# Altium schematic sheet СхемаПолумостовая.SchDoc
size A4; SheetNumber: 1; SheetTotal: 1
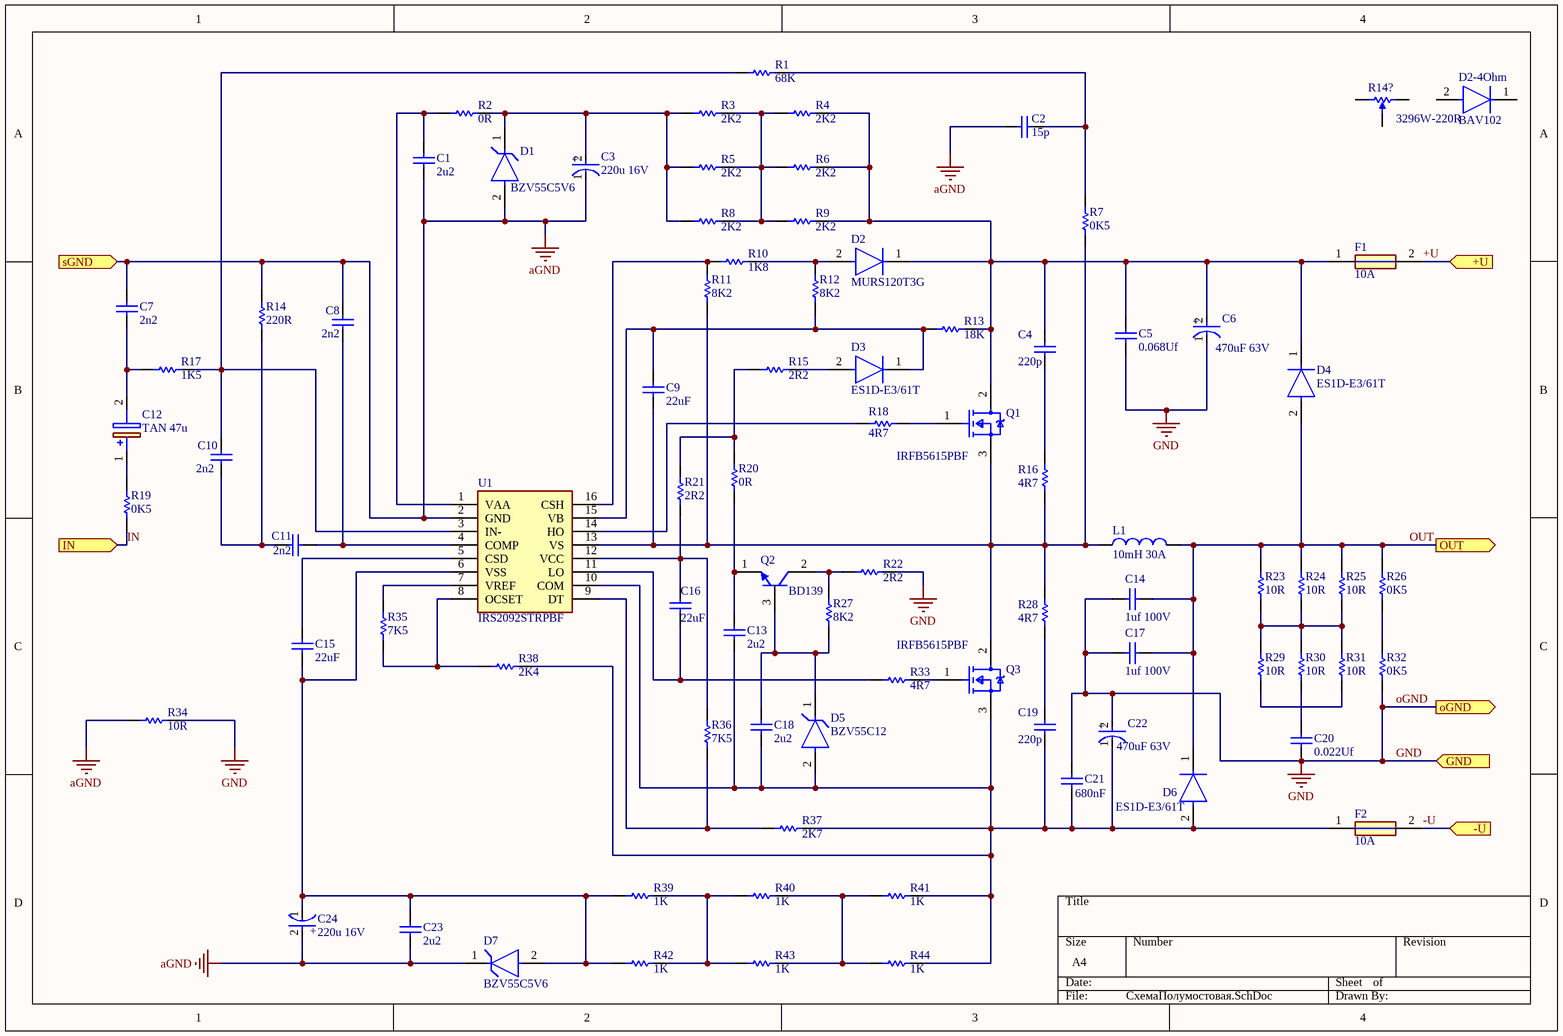
[diagram p0: СхемаПолумостовая.SchDoc]

## Parts
C1  2u2  [CAPC2013X145X50ML20T25]
C2  15p  [CAPC2013X145X50ML20T25]
C3  220u 16V  [FP-OS-CON-SMT-C6-MFG]
C4  220p  [CAPC2013X145X50ML20T25]
C5  0.068Uf  [WCAP-FTX2_L10W6H12_CS]
C6  470uF 63V  [FP-RAD-TH-D_12_5_0_5-L_20-MFG]
C7  2n2  [CAPC2013X145X50ML20T25]
C8  2n2  [CAPC2013X145X50ML20T25]
C9  22uF  [CAPC5950X255X70LL75T35]
C10  2n2  [CAPC2013X145X50ML20T25]
C11  2n2  [CAPC2013X145X50ML20T25]
C12  TAN 47u  [CAPPC5760X640N]
C13  2u2  [CAPC2013X145X50ML20T25]
C14  1uf 100V  [WCAP-FTBP_L18W7H13]
C15  22uF  [CAPC5950X255X70LL75T35]
C16  22uF  [CAPC5950X255X70LL75T35]
C17  1uf 100V  [WCAP-FTBP_L18W7H13]
C18  2u2  [CAPC2013X145X50ML20T25]
C19  220p  [CAPC2013X145X50ML20T25]
C20  0.022Uf  [WCAP-FTX2_L13W4.5H9.5]
C21  680nF  [WCAP-FTX2_L10W6H12_CS]
C22  470uF 63V  [FP-RAD-TH-D_12_5_0_5-L_20-MFG]
C23  2u2  [CAPC2013X145X50ML20T25]
C24  220u 16V  [FP-OS-CON-SMT-C6-MFG]
D1  BZV55C5V6  [FP-DO-213AA-MFG]
D2  MURS120T3G  [FP-403A-03-MFG]
D2-4Ohm  BAV102  [FP-100AD-IPC_A]
D3  ES1D-E3/61T  [FP-95400-MFG]
D4  ES1D-E3/61T  [FP-95400-MFG]
D5  BZV55C12  [FP-DO-213AA-MFG]
D6  ES1D-E3/61T  [FP-95400-MFG]
D7  BZV55C5V6  [FP-DO-213AA-MFG]
F1  10A  [FUSC6025X270N]
F2  10A  [FUSC6025X270N]
L1  10mH 30A  [744151]
Q1  IRFB5615PBF  [FP-PG-TO220-3-MFG]
Q2  BD139  [ONSC-TO-225-3-77-09]
Q3  IRFB5615PBF  [FP-PG-TO220-3-MFG]
R1  68K  [RESC2013X60X35ML10T20]
R2  0R  [RESC2013X60X35ML10T20]
R3  2K2  [RESC2013X60X35ML10T20]
R4  2K2  [RESC2013X60X35ML10T20]
R5  2K2  [RESC2013X60X35ML10T20]
R6  2K2  [RESC2013X60X35ML10T20]
R7  0K5  [RESC2013X60X35ML10T20]
R8  2K2  [RESC2013X60X35ML10T20]
R9  2K2  [RESC2013X60X35ML10T20]
R10  1K8  [RESC2013X60X35ML10T20]
R11  8K2  [RESC2013X60X35ML10T20]
R12  8K2  [RESC2013X60X35ML10T20]
R13  18K  [RESC2013X60X35ML10T20]
R14  220R  [RESC2013X60X35ML10T20]
R14?  3296W-220R  [BOUR-3296W-1-3]
R15  2R2  [RESC3116X65X40ML10T20]
R16  4R7  [RESC2013X60X35ML10T20]
R17  1K5  [RESC2013X60X35ML10T20]
R18  4R7  [RESC2013X60X35ML10T20]
R19  0K5  [RESC2013X60X35ML10T20]
R20  0R  [RESC2010(5025)_L]
R21  2R2  [RESC3116X65X40ML10T20]
R22  2R2  [RESC3116X65X40ML10T20]
R23  10R  [RESC2013X60X35ML10T20]
R24  10R  [RESC2013X60X35ML10T20]
R25  10R  [RESC2013X60X35ML10T20]
R26  0K5  [RESC2013X60X35ML10T20]
R27  8K2  [RESC2013X60X35ML10T20]
R28  4R7  [RESC2013X60X35ML10T20]
R29  10R  [RESC2013X60X35ML10T20]
R30  10R  [RESC2013X60X35ML10T20]
R31  10R  [RESC2013X60X35ML10T20]
R32  0K5  [RESC2013X60X35ML10T20]
R33  4R7  [RESC2013X60X35ML10T20]
R34  10R  [RESC2013X60X35ML10T20]
R35  7K5  [RESC2013X60X35ML10T20]
R36  7K5  [RESC2013X60X35ML10T20]
R37  2K7  [RESC2013X60X35ML10T20]
R38  2K4  [RESC2013X60X35ML10T20]
R39  1K  [RESC2013X60X35ML10T20]
R40  1K  [RESC2013X60X35ML10T20]
R41  1K  [RESC2013X60X35ML10T20]
R42  1K  [RESC2013X60X35ML10T20]
R43  1K  [RESC2013X60X35ML10T20]
R44  1K  [RESC2013X60X35ML10T20]
U1  IRS2092STRPBF  [SOIC127P600X175-16N]

## Ports
+U (in), -U (in), GND (in), IN (in), oGND (out), OUT (out), sGND (in)

## Nets
aGND: C1.1 C2.1 C3.1(C) C7.2 C8.2 C23.1 C24.2(A) D1.2(A) D7.1(C) R14.2 R34.1 U1.2(GND) ; port sGND
GND: C5.1 C6.1(C) C14.1 C17.1 C20.1 C21.2 C22.2(A) R22.2 R32.1 R34.2 ; port GND, port oGND  [also labelled oGND]
+U: F1.2 ; port +U
-U: F2.2 ; port -U
IN: R19.1 ; port IN
OUT: C14.2 C17.2 D4.2(A) D6.1(C) L1.2 R23.2 R24.2 R25.2 R26.2 ; port OUT
NetC1_2: C1.2 R2.1 U1.1(VAA)
NetC2_2: C2.2 R1.2 R7.2
NetC3_2: C3.2(A) D1.1(C) R2.2 R3.1 R5.1 R8.1
NetC4_1: C4.1 R16.2
NetC4_2: C4.2 C5.2 C6.2(A) D2.1(C) D4.1(C) F1.1 Q1.2(D) R4.2 R6.2 R9.2 R13.2
NetC7_1: C7.1 C12.2(-) R17.1
NetC8_1: C8.1 C11.2 U1.4(COMP)
NetC9_1: C9.1 L1.1 Q1.3(S) Q3.2(D) R7.1 R11.1 R16.1 R28.2 U1.13(VS)
NetC9_2: C9.2 D3.1(C) R12.1 R13.1 U1.15(VB)
NetC10_1: C10.1 C11.1 R14.1
NetC10_2: C10.2 R1.1 R17.2 U1.3(IN-)
NetC12_1: C12.1(+) R19.2
NetC13_1: C13.1 C18.1 C19.1 C21.1 C22.1(C) D5.2(A) D6.2(A) F2.1 Q3.3(S) R37.2 R38.2 R41.2 R44.2 U1.10(COM)
NetC13_2: C13.2 Q2.1(E) R20.1
NetC15_1: C15.1 C23.2 C24.1(C) D7.2(A) R39.1 R42.1 U1.6(VSS)
NetC15_2: C15.2 U1.5(CSD)
NetC16_1: C16.1 R33.1 U1.11(LO)
NetC16_2: C16.2 R21.1 R36.2 U1.12(VCC)
NetC18_2: C18.2 D5.1(C) Q2.3(B) R27.1
NetC19_2: C19.2 R28.1
NetC20_2: C20.2 R30.1
NetD2_2: D2.2(A) R10.2 R12.2
NetD3_2: D3.2(A) R15.2
NetQ1_1: Q1.1(G) R18.2
NetQ2_2: Q2.2(C) R22.1 R27.2
NetQ3_1: Q3.1(G) R33.2
NetR3_2: R3.2 R4.1 R5.2 R6.1 R8.2 R9.1
NetR10_1: R10.1 R11.2 U1.16(CSH)
NetR15_1: R15.1 R20.2 R21.2
NetR18_1: R18.1 U1.14(HO)
NetR23_1: R23.1 R24.1 R25.1 R29.2 R30.2 R31.2
NetR26_1: R26.1 R32.2
NetR29_1: R29.1 R31.1
NetR35_1: R35.1 R38.1 U1.8(OCSET)
NetR35_2: R35.2 U1.7(VREF)
NetR36_1: R36.1 R37.1 U1.9(DT)
NetR39_2: R39.2 R40.1 R42.2 R43.1
NetR40_2: R40.2 R41.1 R43.2 R44.1

Not connected (* = marked no-connect by the designer): D2-4Ohm 1(C) 2(A); R14? 1(A) 2(B) 3(TAP)

## Notes on the sheet
- (in symbol CMP-05427-001729-1) +
- (in symbol CMP-05428-001013-1) +

## Library data of the parts
C1 C2 C4 C7 C8 C10 C11 C13 C18 C19 C23 = CMP-1036-04819-2: Part Number: C0805C225K9PACTU; Manufacturer: Kemet
C3 C24 = CMP-05428-001013-1: Conductive Polymer Aluminum Solid Capacitors (OS-CON) 220uF ±20% 16V; Life (Hours): 1000Hour; ESR (Equivalent Series Resistance): 22mR; Case/Package: Radial; Mount: Surface Mount; Packaging: Tape and Reel; Tolerance: 20%; Min Operating Temperature: -55°C; Max Operating Temperature: 125°C; Capacitance: 220uF; Voltage Rating: 16V
C5 C21 = CMP-03913-51400083-2: 890324022017CS Capacitor, Film, Polypropylene, 0.068Uf, 275Vac, Radial; Voltage Rating (AC): 275V; Insulation Resistance: 30GΩ; Hole Diameter: 900µm; Capacitance: 68nF; Pitch: 7.5mm; Dielectric: PP; Pin Length: 4mm; Tolerance: 10%; Height - Seated (Max): 12.4968mm; NexarPartId: 51400083; REACH SVHC: Unknown; Packaging: Carton; Lead Pitch: 7.493mm; Length: 10mm; RoHS: Compliant; Mount: Through Hole; Width: 6mm; Voltage Rating (DC): 275V; Case/Package: Radial; Height: 12mm; Termination: PC Pins; Dielectric Material: PP; Voltage Rating: 275V; Min Operating Temperature: -40°C; Max Operating Temperature: 105°C
C6 C22 = CMP-05427-001729-1: Aluminum Electrolytic Capacitors (Radial Lead Type) AEC-Q200 Qualified 470uF ±20% 63V; Life (Hours): 2000Hour; Lead Diameter: 0.6mm; Ripple Current: 640mA; Lead/Base Style: Straight; Contact Plating: Tin; Case/Package: Radial; Max Operating Temperature: 105°C; Termination: Radial; Series: NHG; Package Quantity: 500; Tolerance: 20%; RoHS Compliant: Yes; Min Operating Temperature: -55°C; Construction: RADIAL; Lead Pitch: 5mm; Capacitance: 470uF; Diameter: 12.5mm; Voltage Rating (DC): 63V; Packaging: Ammo Pack; Length: 20mm; Radiation Hardening: No; Height: 20mm; Mount: Through Hole
C9 C15 C16 = CMP-1664-00005-1: Chip Capacitor, 22 uF, +/- 10%, 25 V, -55 to 125 degC, 2220 (5650 Metric), RoHS, Tape and Reel; Current Rating: 20 A; Voltage Rating: 33 V; Resistance: 200 mohm; Case\Package: 1812; RoHSCompliant: true; DatasheetVersion: Feb-16; REACH SVHC: No SVHC; Case Code (Imperial): 1812; PackageDescription: 2-Pin Surface Mount Device, Body 5.9 x 5 mm; Nominal Supply Voltage: 33 V; ComponentLink2Description: Datasheet; Case Code (Metric): 4532; Max Operating Temperature: 85 degC; Package Quantity: 1000; Height: 2 mm; Min Operating Temperature: -40 degC; Width: 3.41 mm; ComponentLink1URL: http://www.kemet.com/; Mount: Surface Mount; ComponentLink2URL: http://www.mouser.com/ds/2/212/KEM_C1013_X7R_FT-CAP_SMD-346914.pdf; Length: 4.73 mm; ComponentLink1Description: Manufacturer URL; Packaging: Tape and Reel; PackageReference: 2220
C12 = 597D476X0050Z2T: Capacitor Polarised; Manufacturer_Name: Vishay; Datasheet Link: http://www.vishay.com/doc?40047; Height: 6.4mm; Manufacturer_Part_Number: 597D476X0050Z2T; Mouser Part Number: 71-597D476X0050Z2T; Mouser Price/Stock: https://www.mouser.co.uk/ProductDetail/Vishay-Sprague/597D476X0050Z2T?qs=cyBetVxIfqkOZXvQZwfF4Q%3D%3D; Arrow Part Number: 597D476X0050Z2T; Arrow Price/Stock: https://www.arrow.com/en/products/597d476x0050z2t/vishay?region=nac
C14 C17 = CMP-03913-89437293-1: 890273325009CS Cap, 1Uf, 250V, Film, Radial Rohs Compliant: Yes; ESR (Equivalent Series Resistance): 22.08mΩ; Pin Length: 4mm; Pitch: 15mm; Capacitance: 1µF; NexarPartId: 89437293; Packaging: Carton; Voltage Rating: 250V; RoHS: Compliant; Height: 13mm; Length: 18mm; Width: 7mm
C20 = CMP-03913-52220317-2: 890324023011 Film Capacitor, Wcap-Ftx2 Series, 0.022 F, 10%, Pp (Polypropylene), 275 Vac Rohs Compliant: Yes; Voltage Rating: 275V; Capacitance: 22nF; Insulation Resistance: 30GΩ; Pitch: 10mm; Pin Length: 18mm; Hole Diameter: 900µm; Packaging: Bulk; Lead Pitch: 10.0076mm; Height: 9.5mm; Tolerance: 10%; REACH SVHC: Unknown; Dielectric Material: PP; RoHS: Compliant; Case/Package: Radial; Width: 4.5mm; Min Operating Temperature: -40°C; Max Operating Temperature: 105°C; Voltage Rating (DC): 275V; Mount: Through Hole; NexarPartId: 52220317; Height - Seated (Max): 10.0076mm; Termination: PC Pins; Dielectric: PP; Voltage Rating (AC): 275V; Length: 13mm
D1 D7 = CMP-00252-16640727-1: BZV55C5V6 Diode Zener Single 5.6V 2% 3.33mW 2-Pin MELF DO-213AA Bag; Test Current: 5mA; Voltage Tolerance: 7%; Min Operating Temperature: -65°C; RoHS: Non-Compliant; Element Configuration: Single; Number of Pins: 2; NexarPartId: 16640727; Zener Voltage: 5.6V; Lifecycle Status: Production; Mount: Surface Mount; Tolerance: 7%; Max Operating Temperature: 175°C
D2 = CMP-0902-00001-3: DIODE GEN PURP 200V 2A SMB; Element Configuration: Single; Recovery Time: 35ns; Output Current: 1A; Max Surge Current: 40A; Forward Voltage: 875mV; Peak Reverse Current: 2uA; Polarity: Standard; Average Rectified Current: 2A; Max Repetitive Reverse Voltage (Vrrm): 200V; Voltage Rating (DC): 200V; Height: 2.13mm; Reverse Voltage: 200V; Packaging: Tape and Reel; Min Operating Temperature: -65°C; Contact Plating: Tin; Forward Current: 2A; Max Operating Temperature: 175°C; Length: 4.32mm; REACH SVHC: No SVHC; Number of Pins: 2; Case/Package: SMB; Width: 3.56mm; Peak Non-Repetitive Surge Current: 40A; Lead Free: Lead Free; Current Rating: 1A; Max Forward Surge Current (Ifsm): 40A; Reverse Recovery Time: 35ns; Package Quantity: 2500; Radiation Hardening: No; Max Reverse Voltage (DC): 200V
D2-4Ohm = CMP-00278-84324523-1: BAV102 Diode Ultra Fast Recovery Rectifier 200V 0.2A 2-Pin LL-34 T/R; Manufacturer Lifecycle Status: ACTIVE; Power Dissipation: 500mW; Max Junction Temperature (Tj): 200°C; Output Current: 200mA; Reverse Recovery Time: 50ns; Max Reverse Voltage (DC): 150V; Max Surge Current: 4A; Polarity: Standard; Capacitance: 5pF; Max Forward Surge Current (Ifsm): 1A; Element Configuration: Single; Forward Voltage: 1.25V; Peak Reverse Current: 100nA; Min Operating Temperature: -65°C; Voltage Rating (DC): 200V; Mount: Surface Mount; RoHS: Compliant; Radiation Hardening: No; Average Rectified Current: 200mA; Peak Non-Repetitive Surge Current: 4A; Case/Package: MELF; Height: 1.5mm; Packaging: Cut Tape; Reverse Voltage: 200V; Max Repetitive Reverse Voltage (Vrrm): 200V; Current Rating: 200mA; Lead Free: Lead Free; NexarPartId: 84324523; Forward Current: 200mA; Schedule B: 8541100080, 8541100080; Max Operating Temperature: 200°C; Number of Pins: 34; Weight: 51.84mg; Lifecycle Status: Production; Recovery Time: 50ns
D3 D4 D6 = CMP-02540-000037-1: DIODE GEN PURP 200V 1A DO214AC; Manufacturer: Vishay; Standoff Height: 0mm; Peak Reverse Current: 5uA; Value: 10 pF; Max Surge Forward Current: 30A; Max Junction Temp: +150°C; Device Class L3: Rectifier Diodes; RoHS: TRUE; Device Class L1: Discrete Semiconductors; Lead Free: Yes; ComponentLink2Description: Datasheet; Digikey Description: DIODE GEN PURP 200V 1A DO214AC; Device Class L2: Diodes; Package: 95400; Max Repetitive Reverse Voltage: 200V; Footprint Url: http://www.vishay.com/docs/95400/sma.pdf; Temperature Range High: +150°C; ComponentLink2URL: http://www.vishay.com/docs/88586/es1.pdf; Automotive: No; Octopart: https://octopart.com/es1d-e3%2F61t-vishay-39550266; Manufacturer Part Number: ES1D-E3/61T; Temperature: -55°C to +150°C; Category: Diode; Temperature Range Low: -55°C; Height: 2.29mm; Capacitance: 10 pF; Mouser Description: Ultrafast Rectifier, Plastic Surface Mount, 1 A, 200 VDC, DO0214AC (SMA), RoHS; Forward Current: 1A
D5 = CMP-00252-75067900-1: BZV55C12 Zener Diode Single 12.05V 5% 25Ohm 500mW 2-Pin DO-213AA; Max Reverse Leakage Current: 100nA; Power Dissipation: 3.33mW; Reverse Voltage: 8V; Min Operating Temperature: -65°C; Zener Voltage: 12.05V; Height: 1.7mm; Max Operating Temperature: 175°C; NexarPartId: 75067900
F1 F2 = CCF1N10TTE: Fuse; Manufacturer_Name: KOA Speer; Datasheet Link: https://componentsearchengine.com/Datasheets/1/CCF1N10TTE.pdf; Height: 2.7mm; Manufacturer_Part_Number: CCF1N10TTE; Mouser Part Number: 660-CCF1N10TTE; Mouser Price/Stock: https://www.mouser.co.uk/ProductDetail/KOA-Speer/CCF1N10TTE?qs=rZB7yXOqaotLjZpPUC%2Fp3g%3D%3D; Arrow Part Number: CCF1N10TTE; Arrow Price/Stock: https://www.arrow.com/en/products/ccf1n10tte/koa-speer-electronics?region=nac
L1 = CMP-03913-22803296-1: 744151 48 µH ±20% Ferrite Toroidal Inductor, 8.1A Idc, 25mO Rdc WE-SI; Inductance: 48µH; Series Resistance: 25mΩ; Pin Length: 12mm; Max DC Current: 5A; Pitch: 1mm; NexarPartId: 22803296; Tolerance: 20%; Length: 30mm; Depth: 12mm; Width: 12.1mm; Height: 12mm; Ambient Temperature Range Low: -40°C; Mount: Wire; Min Operating Temperature: -40°C; RoHS: Compliant; Diameter: 30mm; Lead Pitch: 10mm; Max Operating Temperature: 105°C; Core Material: Ferrite; Current Rating: 8.1A; Ambient Temperature Range High: 65°C
Q1 Q3 = CMP-32901-000279-1: MOSFET N-CH 150V 35A TO-220AB; Drain to Source Resistance: 39mR; Element Configuration: Single; Input Capacitance: 1.75nF; Turn-On Delay Time: 8.6ns; Threshold Voltage: 3V; Max Power Dissipation: 144W; Turn-Off Delay Time: 17.1ns; Gate to Source Voltage (Vgs): 20V; Packaging: Rail/Tube; RoHS Compliant: Yes; REACH SVHC: No SVHC; Max Operating Temperature: 175°C; Drain to Source Voltage (Vdss): 150V; Lead Free: Contains Lead; Width: 0.19inch; Mount: Through Hole; Halogen Free: Not Halogen Free; Height: 0.65inch; Max Dual Supply Voltage: 150V; Power Dissipation: 144W; Min Operating Temperature: -55°C; Continuous Drain Current (ID): 35A; Number of Pins: 3; Case/Package: TO-220; Rds On Max: 39mR; Length: 0.42inch
Q2 = CMP-1048-01271-1: Plastic Medium-Power Silicon NPN Transistor, 3-Pin TO-225, Bulk Box; Manufacturer: On Semiconductor; IC Continuous (A): 1.5; Packing: Bulk Box; ComponentLink2URL: http://www.onsemi.com/pub_link/Collateral/BD135-D.PDF; ComponentLink2Description: Datasheet; ComponentLink1URL: http://www.onsemi.com/; Polarity: NPN; PartNumber: BD139; ComponentLink1Description: Manufacturer URL; RoHS: FALSE; ComponentLink3Description: Package Specification; PackageReference: TO-225-3-77-09; Mounting Technology: Through Hole; DatasheetVersion: Rev. 16; PackageDescription: 3-Pin Flange Mount, Vertical Straight Lead, Body 7.6 x 2.7 mm, Pitch 2.29 mm; PackageVersion: Rev. AC, 12/2013; ComponentLink3URL: http://www.onsemi.com/pub_link/Collateral/77-09.PDF
R1 R3-R6 R8 R9 R11-R13 R17 R27 R35-R37 = CMP-2100-03671-1: Chip Resistor, 1 KOhm, +/- 1%, 125 mW, -55 to 155 degC, 0805 (2012 Metric), RoHS, Tape and Reel; Manufacturer: Yageo; Temperature Coefficient: 100ppm/degreesC; Voltage Rating (DC): 150V; Max Power Dissipation: 125mW; Resistance: 1.5KOhm; Number of Pins: 2; Number of Terminations: 2; Datasheet URL: http://www.yageo.com/NewPortal/yageodocoutput?fileName=/pdf/R-Chip/PYu-RC_Group_51_RoHS_L_5.pdf; Length: 0.079inch; Package Description: 2-Pin Surface Mounted Device, Body 2 x 1.25 mm; Depth: 1.25mm; Height: 0.024inch; Military Standard: Not; Case/Package: 0805; Package Reference: 0805; RoHSCompliant: true; Lead Free: LeadFree; Packaging: TapeandReel; Package Quantity: 1; Datasheet Version: Rev. 5, 10/2016; Tolerance: 1%; Min Operating Temperature: -55degC; Voltage Rating: 150V; Composition: ThickFilm; Case Code (Imperial): 0805; Power Rating: 125mW; Width: 0.049inch; Case Code (Metric): 2012; Manufacturer URL: http://www.yageo.com/; Max Operating Temperature: 155degC; REACH SVHC: Unknown; Termination: SMD/SMT
R2 R7 R14 R16 R18 R19 R23-R26 R28-R34 R38-R44 = CMP-2100-03671-1: Chip Resistor, 1 KOhm, +/- 1%, 125 mW, -55 to 155 degC, 0805 (2012 Metric), RoHS, Tape and Reel; Manufacturer: Yageo; Temperature Coefficient: 100ppm/degreesC; Voltage Rating (DC): 150V; Max Power Dissipation: 125mW; Resistance: 1KOhm; Number of Pins: 2; Number of Terminations: 2; Datasheet URL: http://www.yageo.com/NewPortal/yageodocoutput?fileName=/pdf/R-Chip/PYu-RC_Group_51_RoHS_L_5.pdf; Length: 0.079inch; Package Description: 2-Pin Surface Mounted Device, Body 2 x 1.25 mm; Depth: 1.25mm; Height: 0.024inch; Military Standard: Not; Case/Package: 0805; Package Reference: 0805; RoHSCompliant: true; Lead Free: LeadFree; Packaging: TapeandReel; Package Quantity: 1; Datasheet Version: Rev. 5, 10/2016; Tolerance: 1%; Min Operating Temperature: -55degC; Voltage Rating: 150V; Composition: ThickFilm; Case Code (Imperial): 0805; Power Rating: 125mW; Width: 0.049inch; Case Code (Metric): 2012; Manufacturer URL: http://www.yageo.com/; Max Operating Temperature: 155degC; REACH SVHC: Unknown; Termination: SMD/SMT
R10 = CMP-2100-03671-1: Chip Resistor, 1 KOhm, +/- 1%, 125 mW, -55 to 155 degC, 0805 (2012 Metric), RoHS, Tape and Reel; Manufacturer: Yageo; Temperature Coefficient: 100ppm/degreesC; Voltage Rating (DC): 150V; Max Power Dissipation: 125mW; Resistance: 1.8KOhm; Number of Pins: 2; Number of Terminations: 2; Datasheet URL: http://www.yageo.com/NewPortal/yageodocoutput?fileName=/pdf/R-Chip/PYu-RC_Group_51_RoHS_L_5.pdf; Length: 0.079inch; Package Description: 2-Pin Surface Mounted Device, Body 2 x 1.25 mm; Depth: 1.25mm; Height: 0.024inch; Military Standard: Not; Case/Package: 0805; Package Reference: 0805; RoHSCompliant: true; Lead Free: LeadFree; Packaging: TapeandReel; Package Quantity: 1; Datasheet Version: Rev. 5, 10/2016; Tolerance: 1%; Min Operating Temperature: -55degC; Voltage Rating: 150V; Composition: ThickFilm; Case Code (Imperial): 0805; Power Rating: 125mW; Width: 0.049inch; Case Code (Metric): 2012; Manufacturer URL: http://www.yageo.com/; Max Operating Temperature: 155degC; REACH SVHC: Unknown; Termination: SMD/SMT
R14? = CMP-1747-00002-1: Square Trimpot(R) Trimming Potentiometer, 1000 Ohm, -55 to 125 degC, 3-Pin THD, RoHS, Tube; Case\Package: 0603; Tolerance: 1%; Power Rating: 100 mW; Voltage Rating: 75 V; Resistance: 4.7 kohm; ComponentLink2URL: http://www.bourns.com/docs/Product-Datasheets/3296.pdf; Packaging: Tape and Reel; REACH SVHC: Yes; ComponentLink1URL: http://www.bourns.com/; Case Code (Metric): 1608; Width: 0.8 mm; ComponentLink1Description: Manufacturer URL; DatasheetVersion: May-16; Max Operating Temperature: 155 degC; PackageReference: 3296W-1-3; PackageDescription: 3-Pin Through Hole Device, Body 9.53 x 4.83 mm, Pitch 2.54 mm; Weight: 7.1E-05 oz; ComponentLink2Description: Datasheet; RoHSCompliant: true; Min Operating Temperature: -55 degC; Radiation Hardening: No; Case Code (Imperial): 0603; Length: 1.6 mm; Package Quantity: 5000; Pins: 2; Mount: Surface Mount; Height: 0.45 mm
R15 R21 R22 = CMP-2100-03678-1: Chip Resistor, 1 KOhm, +/- 1%, 0.25 W, -55 to 155 degC, 1206 (3216 Metric), RoHS, Tape and Reel; Manufacturer: Yageo; Temperature Coefficient: 100ppm/degreesC; Power Rating: 250mW; Voltage Rating: 200V; Resistance: 1KOhm; Composition: ThickFilm; Min Operating Temperature: -55degC; Tolerance: 1%; REACH SVHC: Unknown; Case Code (Metric): 3216; Military Standard: Not; Datasheet Version: Rev. 5, 10/2016; Package Reference: 1206.0; Case/Package: 1206; Length: 3.1mm; Manufacturer URL: http://www.yageo.com/; Lead Free: LeadFree; RoHSCompliant: true; Termination: SMD/SMT; Packaging: TapeandReel; Package Description: 2-Pin Surface Mount Device, Body 3.1 x 1.6 mm; Depth: 1.6mm; Case Code (Imperial): 1206; Max Operating Temperature: 155degC; Datasheet URL: http://www.yageo.com/NewPortal/yageodocoutput?fileName=/pdf/R-Chip/PYu-RC_Group_51_RoHS_L_5.pdf; Height: 0.55mm
R20 = CMP-1017-00078-1: 1K5 0.75W 5% 2010 (5025 Metric)  SMD; Case-Metric: 5025; Case-EIA: 2010; Value: 1500.00 Ohm; Power: 0.75 W; Tolerance: 5 %; Technology: SMT
U1 = IRS2092STRPBF: Integrated Circuit; Manufacturer_Name: Infineon; Datasheet Link: https://www.infineon.com/dgdl/irs2092.pdf?fileId=5546d462533600a401535675f1be2790; Height: 1.75mm; Manufacturer_Part_Number: IRS2092STRPBF; Mouser Part Number: 942-IRS2092STRPBF; Mouser Price/Stock: https://www.mouser.co.uk/ProductDetail/Infineon-Technologies/IRS2092STRPBF?qs=9%252BKlkBgLFf05m7YE8gkORQ%3D%3D; Arrow Part Number: IRS2092STRPBF; Arrow Price/Stock: https://www.arrow.com/en/products/irs2092strpbf/infineon-technologies-ag?region=nac